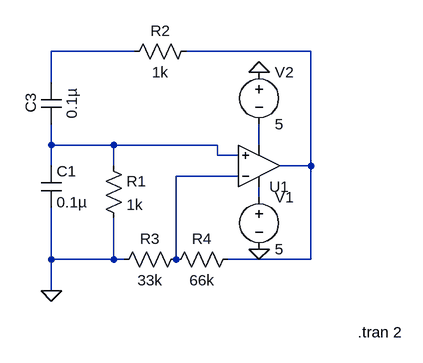
[diagram p0: schematic Draft1.asc]
Draft1.asc, the LTspice schematic file:
Version 4
SHEET 1 880 680
WIRE 176 80 48 80
WIRE 448 80 256 80
WIRE 48 128 48 80
WIRE 48 224 48 192
WIRE 144 224 48 224
WIRE 304 224 144 224
WIRE 368 224 368 192
WIRE 304 240 304 224
WIRE 336 240 304 240
WIRE 48 256 48 224
WIRE 144 256 144 224
WIRE 448 256 448 80
WIRE 448 256 400 256
WIRE 336 272 240 272
WIRE 368 304 368 288
WIRE 48 400 48 320
WIRE 144 400 144 336
WIRE 144 400 48 400
WIRE 160 400 144 400
WIRE 240 400 240 272
WIRE 448 400 448 256
WIRE 448 400 320 400
WIRE 48 448 48 400
FLAG 48 448 0
FLAG 368 112 0
FLAG 368 384 0
SYMBOL UniversalOpAmp 368 256 M180
SYMATTR InstName U1
SYMBOL Res 128 240 R0
SYMATTR InstName R1
SYMATTR Value 1k
SYMBOL Cap 32 256 R0
SYMATTR InstName C1
SYMATTR Value 0.1µ
SYMBOL Cap 32 128 R0
WINDOW 0 0 32 VBottom 2
WINDOW 3 32 32 VTop 2
SYMATTR InstName C3
SYMATTR Value 0.1µ
SYMBOL Res 272 64 R90
WINDOW 0 0 56 VBottom 2
WINDOW 3 32 56 VTop 2
SYMATTR InstName R2
SYMATTR Value 1k
SYMBOL Res 256 384 R90
WINDOW 0 0 56 VBottom 2
WINDOW 3 32 56 VTop 2
SYMATTR InstName R3
SYMATTR Value 33k
SYMBOL Res 336 384 R90
WINDOW 0 0 56 VBottom 2
WINDOW 3 32 56 VTop 2
SYMATTR InstName R4
SYMATTR Value 66k
SYMBOL Voltage 368 288 R0
SYMATTR InstName V1
SYMATTR Value 5
SYMBOL Voltage 368 96 R0
SYMATTR InstName V2
SYMATTR Value 5
TEXT 520 512 Left 2 !.tran 2

The netlist it stands for:
* Draft1.asc
XU1 N003 N005 N006 N004 N002 level1 Avol=1Meg GBW=10Meg Vos=0 En=0 Enk=0 In=0 Ink=0 Rin=500Meg  ; pins In+ In- V+ V- OUT
R1 N003 0 1k
C1 N003 0 0.1µ
C3 N001 N003 0.1µ
R2 N002 N001 1k
R3 N005 0 33k
R4 N002 N005 66k
V1 N006 0 5
V2 0 N004 5
.tran 2
.lib UniversalOpAmp1.lib
.backanno
.end